# Altium schematic sheet MainBoard_V100_GPS.SchDoc
size A4; SheetNumber: 13; SheetTotal: 13
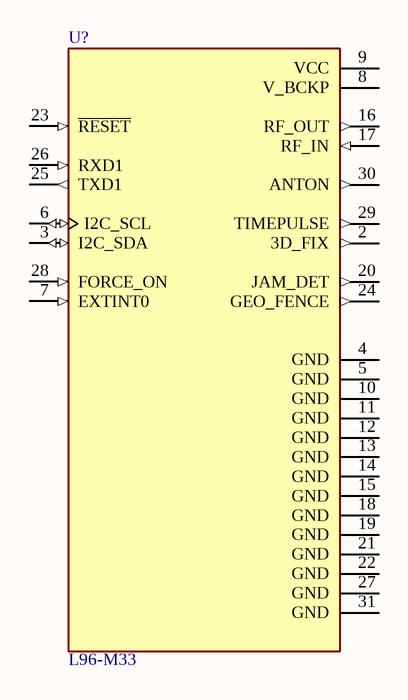
[diagram p0: MainBoard_V100_GPS.SchDoc]

## Parts
U?  L96-M33  [L96-M33]

## Nets

Not connected (* = marked no-connect by the designer): U? 2(3D_FIX) 3(I2C_SDA) 4(GND) 5(GND) 6(I2C_SCL) 7(EXTINT0) 8(V_BCKP) 9(VCC) 10(GND) 11(GND) 12(GND) 13(GND) 14(GND) 15(GND) 16(RF_OUT) 17(RF_IN) 18(GND) 19(GND) 20(JAM_DET) 21(GND) 22(GND) 23(~{RESET}) 24(GEO_FENCE) 25(TXD1) 26(RXD1) 27(GND) 28(FORCE_ON) 29(TIMEPULSE) 30(ANTON) 31(GND)

## Library data of the parts
U? = 369: L96 multi-GNSS receiver module with embedded chip antenna, 33 tracking channels, 99 acquisition channels,GPS+GLONASS+Galileo; MF: Quectel; Azonosító: 369; Package: None; Availability: Unavailable; Value: *; MP: L96-M33; SnapEDA_Link: https://www.snapeda.com/parts/L96-M33/Quectel/view-part/2780781/?ref=snap; Price: None; Part Number: L96-M33; Category: Integrated Circuits; Subcategory: IC_Other; Supplier 1: HESTORE; Supplier 1 order number: 100.443.34; Supplier 2: DIGIKEY; Supplier 2 order number: 2958-L96-M33CT-ND; Help URL: https://auroraevernet.ru/upload/iblock/36c/36c11c043ed14557903899eb54fc4657.pdf